# Altium schematic sheet 1.3.3_Power_board_Servos.SchDoc
size A4; DocumentNumber: 14; SheetNumber: 14; SheetTotal: 14
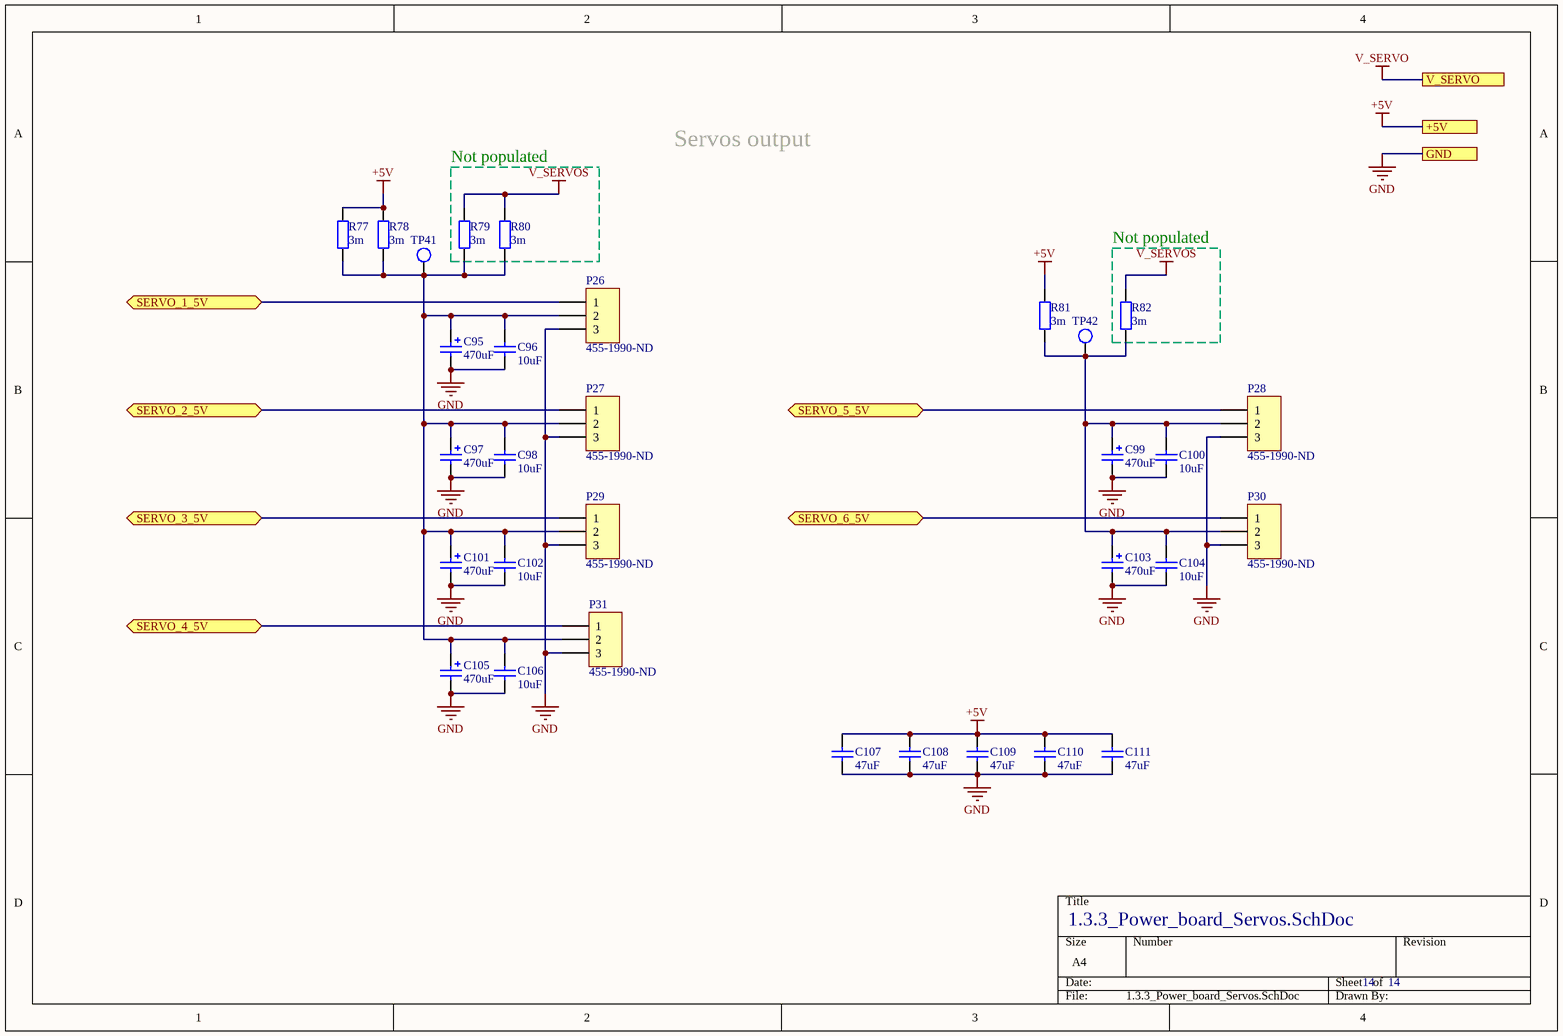
[diagram p0: 1.3.3_Power_board_Servos.SchDoc]

## Parts
C95  470uF  [PCV_10x10]
C96  10uF  [CAP0805W]
C97  470uF  [PCV_10x10]
C98  10uF  [CAP0805W]
C99  470uF  [PCV_10x10]
C100  10uF  [CAP0805W]
C101  470uF  [PCV_10x10]
C102  10uF  [CAP0805W]
C103  470uF  [PCV_10x10]
C104  10uF  [CAP0805W]
C105  470uF  [PCV_10x10]
C106  10uF  [CAP0805W]
C107  47uF  [CAP1206W]
C108  47uF  [CAP1206W]
C109  47uF  [CAP1206W]
C110  47uF  [CAP1206W]
C111  47uF  [CAP1206W]
P26  Supplier Part Number 1: 455-1990-ND  [CON_JST_XA_ B03B-XASK]  (hidden comment: Header 3p JST XA 3A)
P27  Supplier Part Number 1: 455-1990-ND  [CON_JST_XA_ B03B-XASK]  (hidden comment: Header 3p JST XA 3A)
P28  Supplier Part Number 1: 455-1990-ND  [CON_JST_XA_ B03B-XASK]  (hidden comment: Header 3p JST XA 3A)
P29  Supplier Part Number 1: 455-1990-ND  [CON_JST_XA_ B03B-XASK]  (hidden comment: Header 3p JST XA 3A)
P30  Supplier Part Number 1: 455-1990-ND  [CON_JST_XA_ B03B-XASK]  (hidden comment: Header 3p JST XA 3A)
P31  Supplier Part Number 1: 455-1990-ND  [CON_JST_XA_ B03B-XASK]  (hidden comment: Header 3p JST XA 3A)
R77  3m  [2010]
R78  3m  [2010]
R79  3m  [2010]
R80  3m  [2010]
R81  3m  [2010]
R82  3m  [2010]
TP41  Test point  [TP]  (value not drawn)
TP42  Test point  [TP]  (value not drawn)

## Blocks framed on the sheet
Not populated: R79 R80
Not populated: R82

## Ports
+5V, GND, SERVO_1_5V (bidir), SERVO_2_5V (bidir), SERVO_3_5V (bidir), SERVO_4_5V (bidir), SERVO_5_5V (bidir), SERVO_6_5V (bidir), V_SERVO

## Nets
+5V: C107.2 C108.2 C109.2 C110.2 C111.2 R77.2 R78.2 R81.2 ; port +5V
GND: C95.2 C96.1 C97.2 C98.1 C99.2 C100.1 C101.2 C102.1 C103.2 C104.1 C105.2 C106.1 C107.1 C108.1 C109.1 C110.1 C111.1 P26.3 P27.3 P28.3 P29.3 P30.3 P31.3 ; port GND
V_SERVO: port V_SERVO
V_SERVOS: R79.2 R80.2 R82.2
SERVO_1_5V: P26.1 ; port SERVO_1_5V
SERVO_2_5V: P27.1 ; port SERVO_2_5V
SERVO_3_5V: P29.1 ; port SERVO_3_5V
SERVO_4_5V: P31.1 ; port SERVO_4_5V
SERVO_5_5V: P28.1 ; port SERVO_5_5V
SERVO_6_5V: P30.1 ; port SERVO_6_5V
NetC95_1: C95.1 C96.2 C97.1 C98.2 C101.1 C102.2 C105.1 C106.2 P26.2 P27.2 P29.2 P31.2 R77.1 R78.1 R79.1 R80.1 TP41.1
NetC99_1: C99.1 C100.2 C103.1 C104.2 P28.2 P30.2 R81.1 R82.1 TP42.1

## Notes on the sheet
- Servos output

## Library data of the parts
C95 C97 C99 C101 C103 C105 = C_pol_470uF_elec: Polarized Capacitor; Supplier 1: Mouser; Supplier Part Number 1: 647-UWT1E471MNL1S
C96 C98 C100 C102 C104 C106 = C_10uF_16v: Capacitor; Supplier 1: Mouser; Supplier Part Number 1: 81-GRT21BC81C106ME1L
C107-C111 = C_47uF_25v_1206: Capacitor; Supplier 1: Mouser; Supplier Part Number 1: 810-C3216X5R1E476M
R77-R82 = R_2010_2W_3mOhm: 2W 3mOhm; Supplier 1: Mouser; Supplier Part Number 1: 667-ERJ-MP3PF3M0U
P26-P31 = Header 3p JST XA 3A: Supplier 1: Digi-Key